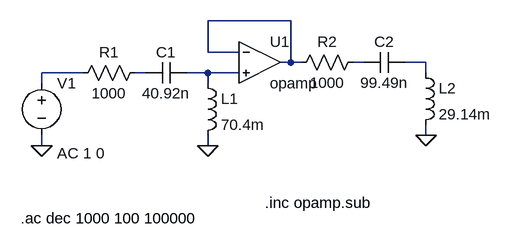
[diagram p0: schematic MP_Orden4_Desnormalizado.asc]
MP_Orden4_Desnormalizado.asc, the LTspice schematic file:
Version 4
SHEET 1 880 680
WIRE 336 32 208 32
WIRE 208 80 208 32
WIRE 256 80 208 80
WIRE 336 96 336 32
WIRE 336 96 320 96
WIRE 352 96 336 96
WIRE 448 96 432 96
WIRE 544 96 512 96
WIRE 16 112 -48 112
WIRE 112 112 96 112
WIRE 208 112 176 112
WIRE 256 112 208 112
WIRE 544 112 544 96
WIRE -48 128 -48 112
WIRE 208 128 208 112
WIRE 544 208 544 192
WIRE -48 224 -48 208
WIRE 208 224 208 208
FLAG 208 224 0
FLAG 544 208 0
FLAG -48 224 0
SYMBOL res 112 96 R90
WINDOW 0 0 56 VBottom 2
WINDOW 3 32 56 VTop 2
SYMATTR InstName R1
SYMATTR Value 1000
SYMBOL cap 176 96 R90
WINDOW 0 0 32 VBottom 2
WINDOW 3 32 32 VTop 2
SYMATTR InstName C1
SYMATTR Value 40.92n
SYMBOL ind 192 112 R0
SYMATTR InstName L1
SYMATTR Value 70.4m
SYMBOL Opamps\\opamp 288 32 R0
SYMATTR InstName U1
SYMBOL res 448 80 R90
WINDOW 0 0 56 VBottom 2
WINDOW 3 32 56 VTop 2
SYMATTR InstName R2
SYMATTR Value 1000
SYMBOL cap 512 80 R90
WINDOW 0 0 32 VBottom 2
WINDOW 3 32 32 VTop 2
SYMATTR InstName C2
SYMATTR Value 99.49n
SYMBOL ind 528 96 R0
SYMATTR InstName L2
SYMATTR Value 29.14m
SYMBOL voltage -48 112 R0
WINDOW 123 24 124 Left 2
WINDOW 39 0 0 Left 0
SYMATTR Value2 AC 1 0
SYMATTR InstName V1
SYMATTR Value ""
TEXT 296 312 Left 2 !.inc opamp.sub
TEXT -80 336 Left 2 !.ac dec 1000 100 100000

The netlist it stands for:
* MP_Orden4_Desnormalizado.asc
R1 N005 N004 1000
C1 N006 N005 40.92n
L1 N006 0 70.4m
XU1 N001 N006 N001 opamp Aol=100K GBW=10Meg  ; pins invin noninvin out
R2 N002 N001 1000
C2 N003 N002 99.49n
L2 N003 0 29.14m
V1 N004 0 AC 1 0
.inc opamp.sub
.ac dec 1000 100 100000
.backanno
.end